# EAGLE design Starter_Shield (EAGLE 7.6.0)
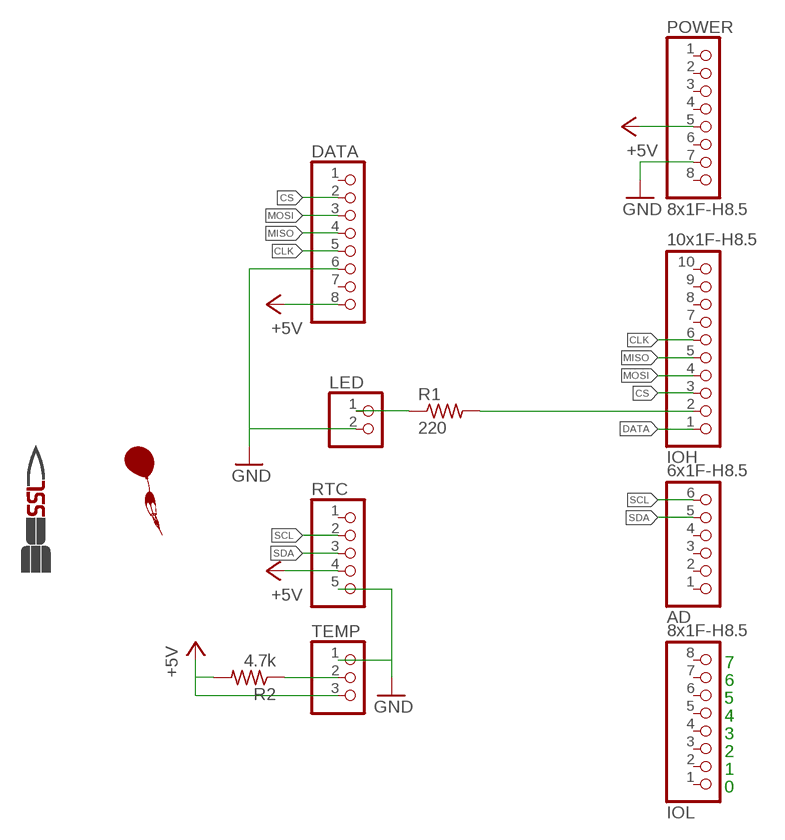
[diagram p0: schematic, sheet 1]

## Parts
AD  6x1F-H8.5  PINHD-1X6  [1X06]
DATA  PINHD-1X8  [1X08]
IMAG1  SSL.53IN  [SSL_.53IN]
IOH  10x1F-H8.5  PINHD-1X10_ARD  [1X10]
IOL  8x1F-H8.5  PINHD-1X8  [1X08]
LED  PINHD-1X2  [1X02]
POWER  8x1F-H8.5  PINHD-1X8  [1X08]
R1  220  R-US_0207/10  [0207/10]
R2  4.7k  R-US_0207/10  [0207/10]
RTC  PINHD-1X5  [1X05]
TEMP  PINHD-1X3  [1X03]
U$1  BALLOON  [BALLOON]

## Nets
+5V: DATA.8 POWER.5 R2.2 RTC.4 TEMP.3
CLK: DATA.5 IOH.6
CS: DATA.2 IOH.3
DATA: IOH.1 R2.1 TEMP.2
GND: DATA.6 LED.2 POWER.7 RTC.5 TEMP.1
MISO: DATA.4 IOH.5
MOSI: DATA.3 IOH.4
N$1: LED.1 R1.1
N$2: IOH.2 R1.2
SCL: AD.6 RTC.2
SDA: AD.5 RTC.3
Unconnected: AD.1 AD.2 AD.3 AD.4 DATA.1 DATA.7 IOH.7 IOH.8 IOH.9 IOH.10 IOL.1 IOL.2 IOL.3 IOL.4 IOL.5 IOL.6 IOL.7 IOL.8 POWER.1 POWER.2 POWER.3 POWER.4 POWER.6 POWER.8 RTC.1

## Notes on the sheet
- 7
- 6
- 5
- 4
- 3
- 2
- 1
- 0

## Library data of the parts
AD = SmartPrj:PINHD-1X6: PIN HEADER
DATA = pinhead:PINHD-1X8: PIN HEADER
IMAG1 = images:SSL
IOH = SmartPrj:PINHD-1X10_ARD: PIN HEADER
IOL POWER = SmartPrj:PINHD-1X8: PIN HEADER
LED = pinhead:PINHD-1X2: PIN HEADER
R1 R2 = resistor:R-US_: RESISTOR, American symbol
RTC = pinhead:PINHD-1X5: PIN HEADER
TEMP = pinhead:PINHD-1X3: PIN HEADER
U$1 = images:BALLOON

## Net classes
0 default: width 0.254 mm, clearance 0.254 mm
1 power: width 0.61 mm, drill 0.61 mm, clearance 0.254 mm
2 gnd: width 0.305 mm, drill 0.559 mm, clearance 0.254 mm
3 usbvcc: width 0.508 mm, drill 0.61 mm, clearance 0.254 mm
4 aref: width 0.406 mm, drill 0.61 mm, clearance 0.254 mm

## Board
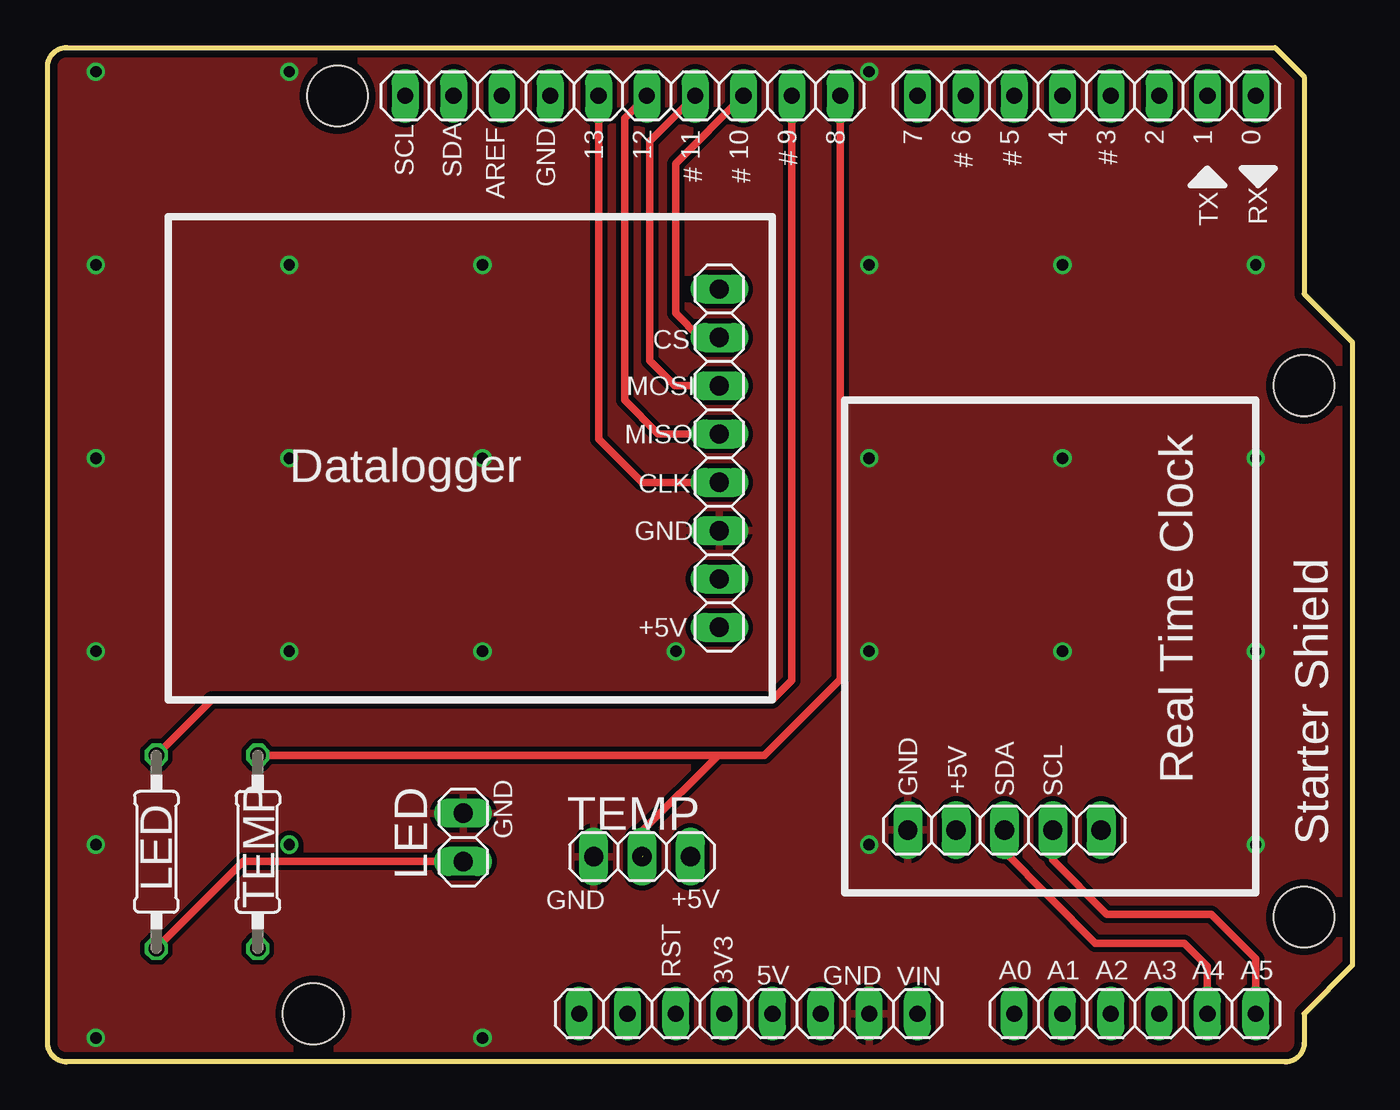
[diagram p1: board, top side]
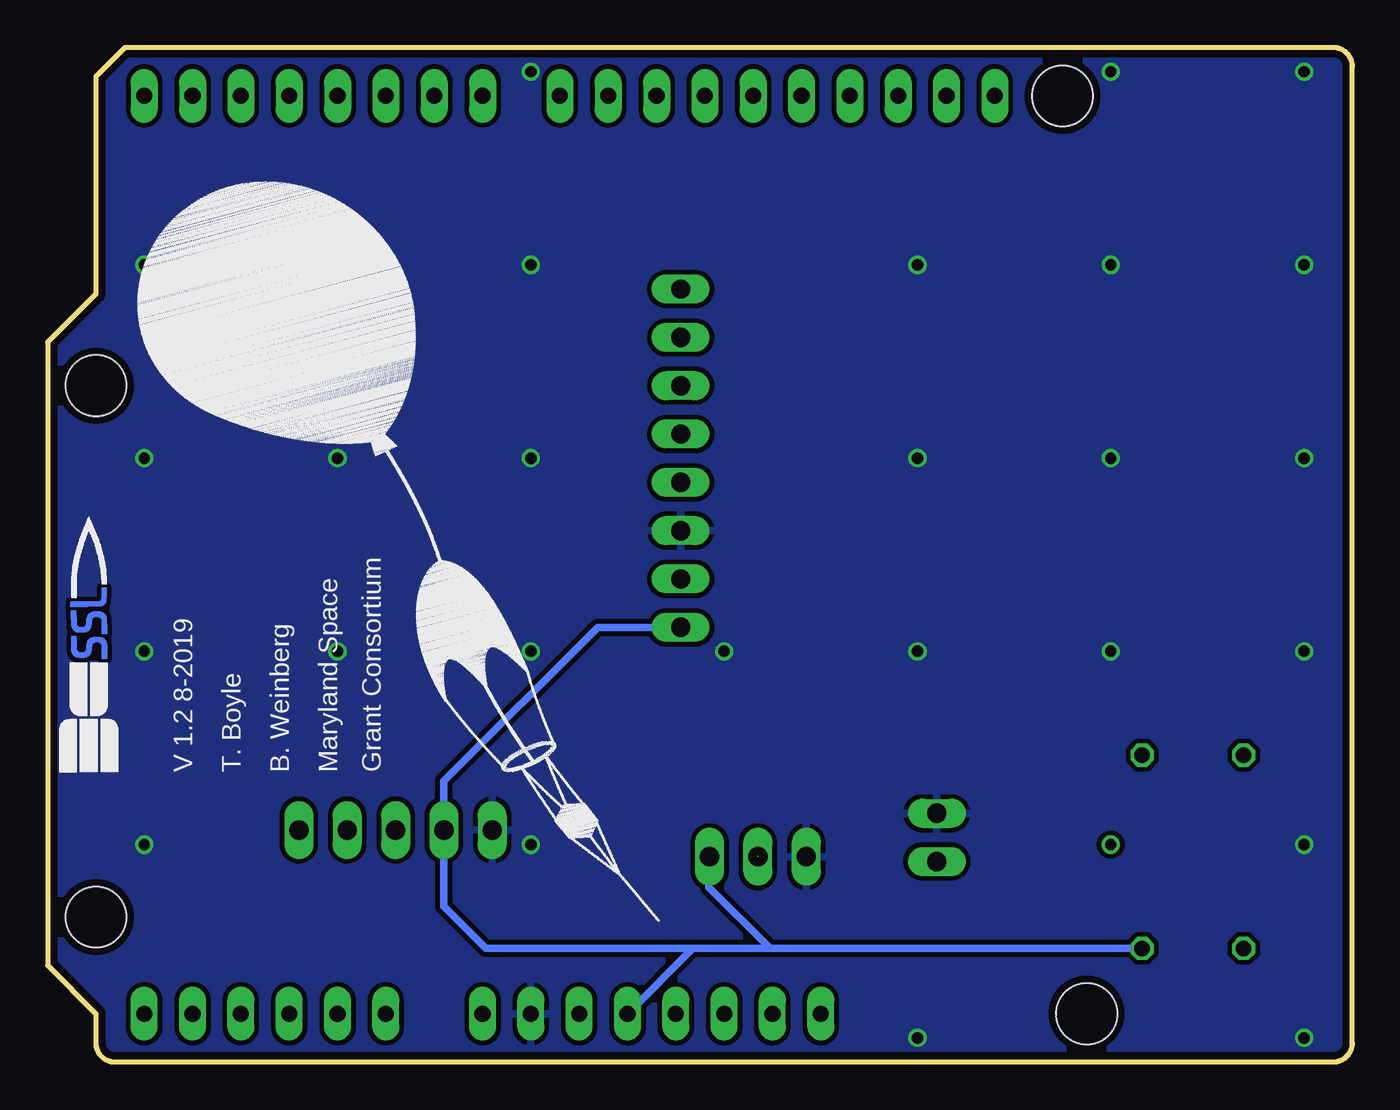
[diagram p2: board, bottom side, seen from below]

Size 68.58 x 53.34 mm. Coordinates in mm from the lower left corner, seen from the top.
Outline: 1,53.34 arc90 0,52.34 0,1 arc90 1,0 65.04,0 arc90 66.04,1 66.04,2.54 68.58,5.08 68.58,37.85 66.04,40.39 66.04,51.82 64.52,53.34 1.02,53.34
Copper layers (1*16): Top 0.0356mm / dielectric 1.5011mm / Bottom 0.0356mm
Design rules "OshPark": minimum track width 6mil, minimum drill 13mil, track to track 6mil, track to pad 6mil, pad to pad 6mil, via to via 6mil, smd to smd 6mil, copper to edge 15mil, drill to drill 6mil, minimum pad ring 7mil, minimum via ring 7mil, stop-mask expansion 3mil, vias tented up to drill 0mil, thermal gap 10mil
Holes 3.2 mm at 66.04,35.56 66.04,7.62 15.24,50.8 13.97,2.54
vRestrict: area 22.9,44.1 to 24.6,49.1; area 25.4,45.5 to 27.1,49.1; area 28.4,45.3 to 29.6,48.8; area 31,45.3 to 32.1,48.8; area 33.5,45.3 to 34.7,48.8; area 36.1,45.3 to 37.2,48.8; area 38.7,47.2 to 39.9,48.8; area 40.3,45.1 to 47.6,46.9; area 60.3,44.2 to 61.7,46.7; area 62.9,44.2 to 64.3,46.7; area 61.3,35.8 to 64.8,37.2; area 0.6,21.8 to 2,30.1; 14 more areas

### Footprints (pad centres in the part's own frame; a part is rotated, then mirrored left to right if it is on the bottom)
1X06 = drill 0.85 pad 1.422 long: 1 -6.35,0; 2 -3.81,0; 3 -1.27,0; 4 1.27,0; 5 3.81,0; 6 6.35,0
1X08 = drill 1.016 long: 1 -8.89,0; 2 -6.35,0; 3 -3.81,0; 4 -1.27,0; 5 1.27,0; 6 3.81,0; 7 6.35,0; 8 8.89,0
1X10 = drill 0.85 pad 1.422 long: 1 -11.43,0; 2 -8.89,0; 3 -6.35,0; 4 -3.81,0; 5 -1.27,0; 6 1.27,0; 7 3.81,0; 8 6.35,0; 9 8.89,0; 10 11.43,0
1X08' = drill 0.85 pad 1.422 long: 1 -8.89,0; 2 -6.35,0; 3 -3.81,0; 4 -1.27,0; 5 1.27,0; 6 3.81,0; 7 6.35,0; 8 8.89,0
1X02 = drill 1.016 long: 1 -1.27,0; 2 1.27,0
0207/10 = drill 0.813 octagon: 1 -5.08,0; 2 5.08,0
1X05 = drill 1.016 long: 1 -5.08,0; 2 -2.54,0; 3 0,0; 4 2.54,0; 5 5.08,0
1X03 = drill 1.016 long: 1 -2.54,0; 2 0,0; 3 2.54,0

### Placement (x,y rotation side)
AD  57.15,2.54 0 top
DATA  35.31,31.75 270 top
IMAG1  68.58,15.24 0 bottom
IOH  30.23,50.8 180 top
IOL  8x1F-H8.5  [1X08']  54.61,50.8 180 top
LED  21.84,11.81 90 top
POWER  8x1F-H8.5  [1X08']  36.83,2.54 0 top
R1  5.71,11.05 90 top
R2  11.05,11.05 270 top
RTC  50.29,12.19 180 top
TEMP  31.24,10.79 0 top
U$1  54.1,2.67 15 bottom

### Tracks (layer width: path | path; a pad name or v marks a point on that pad's centre or on a via)
+5V
  Bottom 0.406: R2.2 30.61,5.97 | 30.61,5.97 33.83,9.2 33.83,10.74 TEMP.3 | POWER.5 34.67,5.97 | 34.67,5.97 30.61,5.97 | 34.67,5.97 45.54,5.97 47.75,8.18 RTC.4 47.75,14.78 39.67,22.86 DATA.8
CLK
  Top 0.406: DATA.5 31.24,30.48 28.96,32.77 IOH.6
CS
  Top 0.406: IOH.3 33.02,47.24 33.02,39.37 34.29,38.1 DATA.2
DATA  (1 unrouted)
  Top 0.406: IOH.1 41.66,20.12 37.67,16.13 35.26,16.13 | R2.1 35.26,16.13 | 31.29,10.85 31.29,12.17 35.26,16.13
GND  (via drill 0.6)
  other vias: 2.54,52.07 2.54,41.91 2.54,31.75 2.54,21.59 2.54,11.43 2.54,1.27 12.7,21.59 12.7,31.75 12.7,41.91 12.7,52.07 22.86,41.91 22.86,31.75 22.86,21.59 22.86,1.27 33.02,21.59 43.18,11.43 43.18,21.59 53.34,21.59 53.34,31.75 43.18,41.91 43.18,52.07 53.34,41.91 63.5,41.91 63.5,31.75 63.5,21.59 63.5,11.43 43.18,31.75
  pour Top: 69.85,58.42 69.85,-1.27 -8.89,-1.27 -8.89,58.42
  pour Bottom: -1.27,54.61 73.66,54.61 73.66,-3.81 -1.27,-3.81
MISO
  Top 0.406: DATA.4 32.11,33.02 30.33,34.8 30.33,49.63 IOH.5
MOSI
  Top 0.406: DATA.3 32.97,35.56 31.65,36.88 31.65,48.41 IOH.4
N$1
  Top 0.406: R1.1 10.29,10.54 LED.1
N$2
  Top 0.406: IOH.2 39.12,20.07 38.1,19.05 8.64,19.05 R1.2
N$15  (via drill 0.6)
  other vias: 12.7,11.43
SCL
  Top 0.406: RTC.2 52.83,10.62 55.68,7.77 61.16,7.77 63.5,5.44 AD.6
SDA
  Top 0.406: RTC.3 50.29,11.07 55.07,6.25 59.74,6.25 60.96,5.03 AD.5

### Text on the board
tPlace: 13 | 12 | 11 | 10 | 9 | 8 | 7 | 6 | 5 | 4 | 3 | 2 | 1 | 0 | CS | MOSI | MISO | Real Time Clock | Datalogger | CLK | GND | +5V | LED | TEMP | GND | +5V | SDA | SCL | GND | Starter Shield | LED | GND | TEMP | +5V
bPlace: Grant Consortium | Maryland Space | B. Weinberg | T. Boyle | V 1.2 8-2019
tNames: AREF | GND | SCL | SDA | # | # | # | # | # | # | TX | RX | RST | 3V3 | 5V | GND | VIN | A0 | A1 | A2 | A3 | A4 | A5
ReferenceLC: L | TX | ON | RX | PC1 | PC2
214bmp: D:/SmartProjects/Snc/a4_bn_logo2.bmp